# EAGLE design Left (EAGLE 8.2.0)
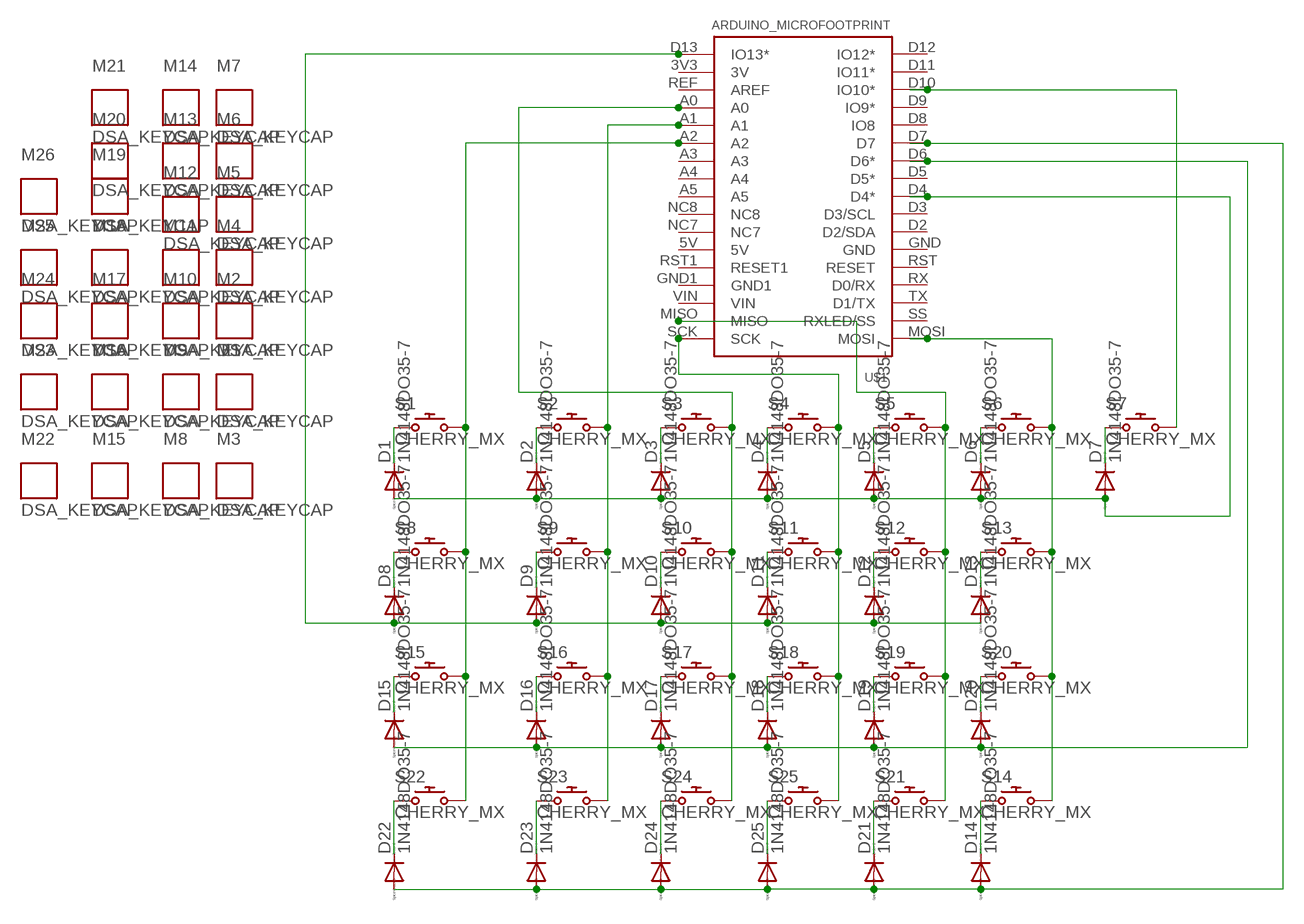
[diagram p0: schematic, sheet 1]

## Parts
D1  1N4148DO35-7  [DO35-7]
D2  1N4148DO35-7  [DO35-7]
D3  1N4148DO35-7  [DO35-7]
D4  1N4148DO35-7  [DO35-7]
D5  1N4148DO35-7  [DO35-7]
D6  1N4148DO35-7  [DO35-7]
D7  1N4148DO35-7  [DO35-7]
D8  1N4148DO35-7  [DO35-7]
D9  1N4148DO35-7  [DO35-7]
D10  1N4148DO35-7  [DO35-7]
D11  1N4148DO35-7  [DO35-7]
D12  1N4148DO35-7  [DO35-7]
D13  1N4148DO35-7  [DO35-7]
D14  1N4148DO35-7  [DO35-7]
D15  1N4148DO35-7  [DO35-7]
D16  1N4148DO35-7  [DO35-7]
D17  1N4148DO35-7  [DO35-7]
D18  1N4148DO35-7  [DO35-7]
D19  1N4148DO35-7  [DO35-7]
D20  1N4148DO35-7  [DO35-7]
D21  1N4148DO35-7  [DO35-7]
D22  1N4148DO35-7  [DO35-7]
D23  1N4148DO35-7  [DO35-7]
D24  1N4148DO35-7  [DO35-7]
D25  1N4148DO35-7  [DO35-7]
M1  DSA_KEYCAP  [DSA_KEYCAP]
M2  DSA_KEYCAP  [DSA_KEYCAP]
M3  DSA_KEYCAP  [DSA_KEYCAP]
M4  DSA_KEYCAP  [DSA_KEYCAP]
M5  DSA_KEYCAP  [DSA_KEYCAP]
M6  DSA_KEYCAP  [DSA_KEYCAP]
M7  DSA_KEYCAP  [DSA_KEYCAP]
M8  DSA_KEYCAP  [DSA_KEYCAP]
M9  DSA_KEYCAP  [DSA_KEYCAP]
M10  DSA_KEYCAP  [DSA_KEYCAP]
M11  DSA_KEYCAP  [DSA_KEYCAP]
M12  DSA_KEYCAP  [DSA_KEYCAP]
M13  DSA_KEYCAP  [DSA_KEYCAP]
M14  DSA_KEYCAP  [DSA_KEYCAP]
M15  DSA_KEYCAP  [DSA_KEYCAP]
M16  DSA_KEYCAP  [DSA_KEYCAP]
M17  DSA_KEYCAP  [DSA_KEYCAP]
M18  DSA_KEYCAP  [DSA_KEYCAP]
M19  DSA_KEYCAP  [DSA_KEYCAP]
M20  DSA_KEYCAP  [DSA_KEYCAP]
M21  DSA_KEYCAP  [DSA_KEYCAP]
M22  DSA_KEYCAP  [DSA_KEYCAP]
M23  DSA_KEYCAP  [DSA_KEYCAP]
M24  DSA_KEYCAP  [DSA_KEYCAP]
M25  DSA_KEYCAP  [DSA_KEYCAP]
M26  DSA_KEYCAP  [DSA_KEYCAP]
S1  CHERRY_MX  [CHERRY_MX]
S2  CHERRY_MX  [CHERRY_MX]
S3  CHERRY_MX  [CHERRY_MX]
S4  CHERRY_MX  [CHERRY_MX]
S5  CHERRY_MX  [CHERRY_MX]
S6  CHERRY_MX  [CHERRY_MX]
S7  CHERRY_MX  [CHERRY_MX]
S8  CHERRY_MX  [CHERRY_MX]
S9  CHERRY_MX  [CHERRY_MX]
S10  CHERRY_MX  [CHERRY_MX]
S11  CHERRY_MX  [CHERRY_MX]
S12  CHERRY_MX  [CHERRY_MX]
S13  CHERRY_MX  [CHERRY_MX]
S14  CHERRY_MX  [CHERRY_MX]
S15  CHERRY_MX  [CHERRY_MX]
S16  CHERRY_MX  [CHERRY_MX]
S17  CHERRY_MX  [CHERRY_MX]
S18  CHERRY_MX  [CHERRY_MX]
S19  CHERRY_MX  [CHERRY_MX]
S20  CHERRY_MX  [CHERRY_MX]
S21  CHERRY_MX  [CHERRY_MX]
S22  CHERRY_MX  [CHERRY_MX]
S23  CHERRY_MX  [CHERRY_MX]
S24  CHERRY_MX  [CHERRY_MX]
S25  CHERRY_MX  [CHERRY_MX]
U$1  ARDUINO_MICROFOOTPRINT  [ARDUINO-MICRO]

## Nets
N$1: D14.A D21.A D22.A D23.A D24.A D25.A U$1.D7
N$3: D8.A D9.A D10.A D11.A D12.A D13.A U$1.D13(IO13*)
N$4: D12.C S12.S1
N$5: S1.S2 S8.S2 S15.S2 S22.S2 U$1.A2
N$6: S2.S2 S9.S2 S16.S2 S23.S2 U$1.A1
N$7: S3.S2 S10.S2 S17.S2 S24.S2 U$1.A0
N$8: S4.S2 S11.S2 S18.S2 S25.S2 U$1.SCK
N$9: S5.S2 S12.S2 S19.S2 S21.S2 U$1.MISO
N$10: S6.S2 S13.S2 S14.S2 S20.S2 U$1.MOSI
N$11: S7.S2 U$1.D10(IO10*)
N$12: D1.C S1.S1
N$13: D8.C S8.S1
N$14: D15.C S15.S1
N$15: D22.C S22.S1
N$16: D23.C S23.S1
N$17: D16.C S16.S1
N$18: D9.C S9.S1
N$19: D2.C S2.S1
N$20: D3.C S3.S1
N$21: D10.C S10.S1
N$22: D17.C S17.S1
N$23: D24.C S24.S1
N$24: D25.C S25.S1
N$25: D18.C S18.S1
N$26: D11.C S11.S1
N$27: D4.C S4.S1
N$28: D5.C S5.S1
N$29: D6.C S6.S1
N$30: D7.C S7.S1
N$31: D14.C S14.S1
N$32: D13.C S13.S1
N$33: D19.C S19.S1
N$34: D20.C S20.S1
N$35: D21.C S21.S1
N$36: D15.A D16.A D17.A D18.A D19.A D20.A U$1.D6(D6*)
N$39: D1.A D2.A D3.A D4.A D5.A D6.A D7.A U$1.D4(D4*)
Unconnected: U$1.3V3(3V) U$1.5V U$1.A3 U$1.A4 U$1.A5 U$1.D2(D2/SDA) U$1.D3(D3/SCL) U$1.D5(D5*) U$1.D8(IO8) U$1.D9(IO9*) U$1.D11(IO11*) U$1.D12(IO12*) U$1.GND U$1.GND1 U$1.NC7 U$1.NC8 U$1.REF(AREF) U$1.RST1(RESET1) U$1.RST(RESET) U$1.RX(D0/RX) U$1.SS(RXLED/SS) U$1.TX(D1/TX) U$1.VIN

## Library data of the parts
D1-D25 = diode:1N4148: DIODE high speed (Philips)
M1-M26 = cherry:DSA_KEYCAP: DSA keycap
S1-S25 = cherry:CHERRY_MX: Cherry keymodule MX; FARNELL: 2292961; MOUSER: 540-MX1A-11NW
U$1 = ArduinoMicro:ARDUINO_MICRO

## Board
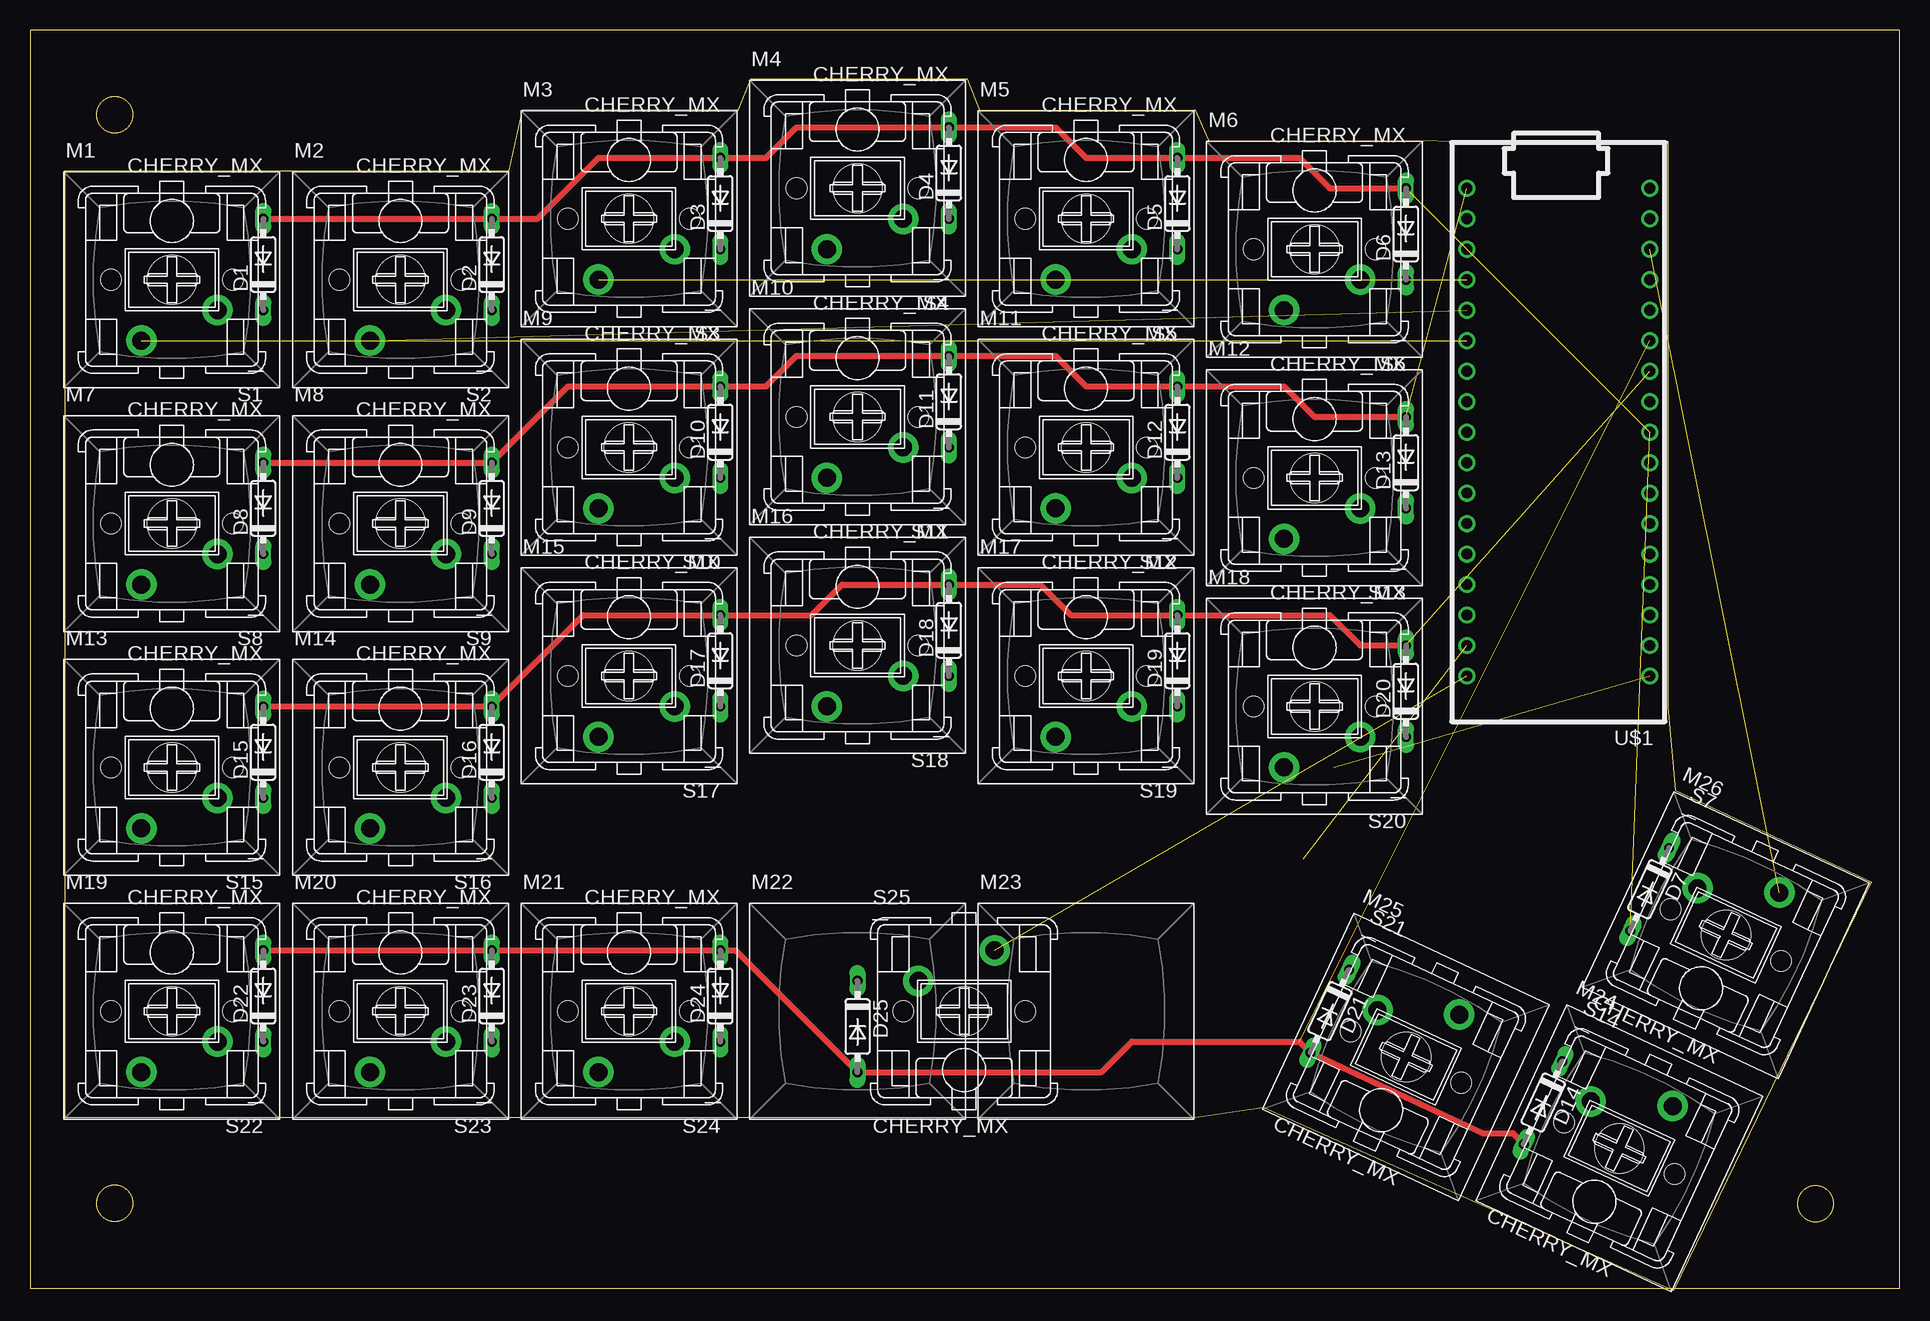
[diagram p1: board, top side]
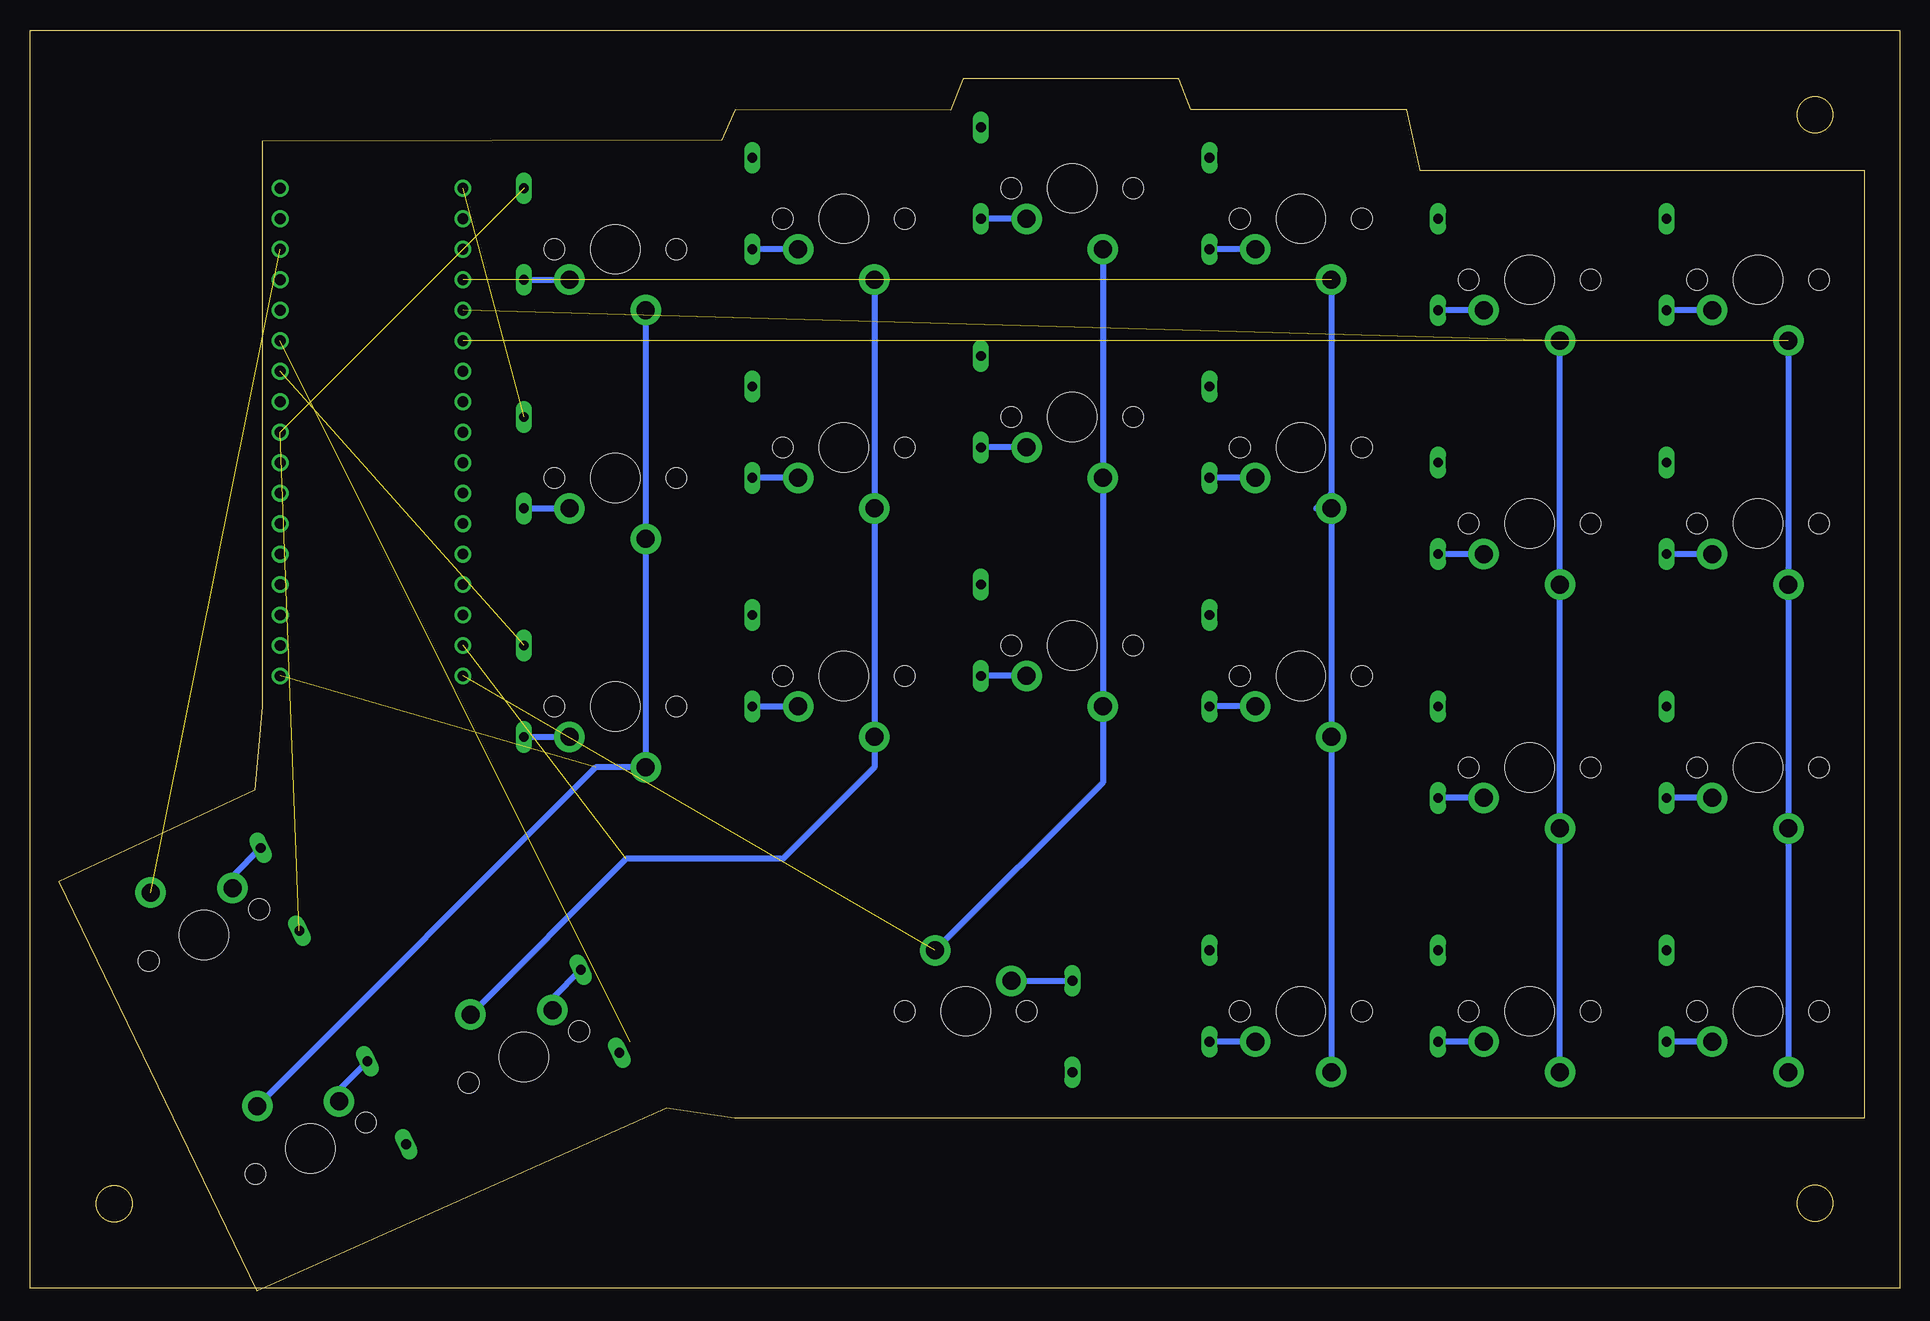
[diagram p2: board, bottom side, seen from below]

Size 155.86 x 105.08 mm. Coordinates in mm from the lower left corner, seen from the top.
Outline: 41.07,98.44 59.07,98.44 60.09,101.02 78.09,101.02 79.14,98.41 97.11,98.44 98.22,95.9 136.5,95.79 136.5,48.7 137.14,41.74 153.47,34.09 136.97,0 102.82,15.25 97.14,14.44 2.94,14.44 2.94,93.33 39.96,93.36 41.07,98.44
Outline: 0,0.21 155.86,0.21 155.86,105.08 0,105.08 0,0.21
Outline: circle at 7.07,98.01 radius 1.5
Outline: circle at 7.07,7.32 radius 1.5
Outline: circle at 148.83,7.28 radius 1.5
Copper layers (1*16): Top 0.035mm / dielectric 1.5mm / Bottom 0.035mm
Design rules "default *": minimum track width 6mil, minimum drill 0.35mm, track to track 12mil, track to pad 6mil, pad to pad 6mil, via to via 6mil, smd to smd 6mil, copper to edge 40mil, drill to drill 40mil, minimum pad ring 10mil, minimum via ring 8mil, stop-mask expansion 4mil, vias tented up to drill 0mil, thermal gap 10mil

### Footprints (pad centres in the part's own frame; a part is rotated, then mirrored left to right if it is on the bottom)
DO35-7 = drill 0.813 long: A 3.81,0; C -3.81,0
CHERRY_MX = drill 1.5 pad 2.54: S1 -3.81,2.54; S2 2.54,5.08 | hole 1.7: -5.08,0; 5.08,0 | hole 4.1: 0,0
ARDUINO-MICRO = drill 0.9: 3V3 16.51,3.81; 5V 16.51,29.21; A0 16.51,8.89; A1 16.51,11.43; A2 16.51,13.97; A3 16.51,16.51; A4 16.51,19.05; A5 16.51,21.59; D2 1.27,26.67; D3 1.27,24.13; D4 1.27,21.59; D5 1.27,19.05; D6 1.27,16.51; D7 1.27,13.97; D8 1.27,11.43; D9 1.27,8.89; D10 1.27,6.35; D11 1.27,3.81; D12 1.27,1.27; D13 16.51,1.27; GND 1.27,29.21; GND1 16.51,34.29; MISO 16.51,39.37; MOSI 1.27,41.91; NC7 16.51,26.67; NC8 16.51,24.13; REF 16.51,6.35; RST 1.27,31.75; RST1 16.51,31.75; RX 1.27,34.29; SCK 16.51,41.91; SS 1.27,39.37; TX 1.27,36.83; VIN 16.51,36.83

### Placement (x,y rotation side)
D1  19.45,85.54 90 top
D2  38.5,85.54 90 top
D3  57.55,90.62 90 top
D4  76.6,93.16 90 top
D5  95.65,90.62 90 top
D6  114.7,88.08 90 top
D7  135.02,33.47 245 top
D8  19.45,65.22 90 top
D9  38.5,65.22 90 top
D10  57.55,71.57 90 top
D11  76.6,74.11 90 top
D12  95.65,71.57 90 top
D13  114.7,69.03 90 top
D14  126.13,15.69 245 top
D15  19.45,44.9 90 top
D16  38.5,44.9 90 top
D17  57.55,52.52 90 top
D18  76.6,55.06 90 top
D19  95.65,52.52 90 top
D20  114.7,49.98 90 top
D21  108.35,23.31 245 top
D22  19.45,24.58 90 top
D23  38.5,24.58 90 top
D24  57.55,24.58 90 top
D25  68.98,22.04 270 top
M1  11.83,84.27 0 top
M2  30.88,84.27 0 top
M3  49.93,89.35 0 top
M4  68.98,91.89 0 top
M5  88.03,89.35 0 top
M6  107.08,86.81 0 top
M7  11.83,63.95 0 top
M8  30.88,63.95 0 top
M9  49.93,70.3 0 top
M10  68.98,72.84 0 top
M11  88.03,70.3 0 top
M12  107.08,67.76 0 top
M13  11.83,43.63 0 top
M14  30.88,43.63 0 top
M15  49.93,51.25 0 top
M16  68.98,53.79 0 top
M17  88.03,51.25 0 top
M18  107.08,48.71 0 top
M19  11.83,23.31 0 top
M20  30.88,23.31 0 top
M21  49.93,23.31 0 top
M22  68.98,23.31 0 top
M23  88.03,23.31 0 top
M24  132.48,11.88 335 top
M25  114.7,19.5 335 top
M26  141.37,29.66 335 top
S1  11.83,84.27 180 top
S2  30.88,84.27 180 top
S3  49.93,89.35 180 top
S4  68.98,91.89 180 top
S5  88.03,89.35 180 top
S6  107.08,86.81 180 top
S7  141.37,29.66 335 top
S8  11.83,63.95 180 top
S9  30.88,63.95 180 top
S10  49.93,70.3 180 top
S11  68.98,72.84 180 top
S12  88.03,70.3 180 top
S13  107.08,67.76 180 top
S14  132.48,11.88 335 top
S15  11.83,43.63 180 top
S16  30.88,43.63 180 top
S17  49.93,51.25 180 top
S18  68.98,53.79 180 top
S19  88.03,51.25 180 top
S20  107.08,48.71 180 top
S21  114.7,19.5 335 top
S22  11.83,23.31 180 top
S23  30.88,23.31 180 top
S24  49.93,23.31 180 top
S25  77.87,23.31 0 top
U$1  136.29,93.16 180 top

### Tracks (layer width: path | path; a pad name or v marks a point on that pad's centre or on a via)
N$1  (1 unrouted)
  Top 0.508: D22.A D23.A D24.A 58.82,28.39 D25.A 89.3,18.23 91.84,20.77 105.82,20.77 D21.A 121.05,13.15 123.6,13.15 D14.A
N$3  (1 unrouted)
  Top 0.508: D8.A D9.A 44.85,75.38 D10.A 61.36,75.38 63.9,77.92 D11.A 85.49,77.92 88.03,75.38 D12.A 104.54,75.38 107.08,72.84 D13.A
N$4
  Bottom 0.508: S12.S1 D12.C
N$5  (1 unrouted)
  Bottom 0.508: S1.S2 S8.S2 | S8.S2 9.29,57.6 S8.S2 | S8.S2 S15.S2 S22.S2
N$6  (1 unrouted)
  Bottom 0.508: S23.S2 S16.S2 S9.S2 S2.S2
N$7  (1 unrouted)
  Bottom 0.508: S3.S2 47.39,66.49 48.66,65.22 S10.S2 S17.S2 S24.S2
N$8  (1 unrouted)
  Bottom 0.508: S4.S2 S11.S2 S18.S2 66.44,42.36 S25.S2
N$9  (1 unrouted)
  Bottom 0.508: S5.S2 S12.S2 S19.S2 85.49,43.63 93.11,36.01 106.17,36.01 S21.S2
N$10  (1 unrouted)
  Bottom 0.508: S6.S2 S13.S2 S20.S2 108.71,43.63 S14.S2
N$11  (1 unrouted)
N$12
  Bottom 0.508: S1.S1 D1.C
N$13
  Bottom 0.508: S8.S1 D8.C
N$14
  Bottom 0.508: S15.S1 D15.C
N$15
  Bottom 0.508: S22.S1 D22.C
N$16
  Bottom 0.508: S23.S1 D23.C
N$17
  Bottom 0.508: S16.S1 D16.C
N$18
  Bottom 0.508: S9.S1 D9.C
N$19
  Bottom 0.508: S2.S1 D2.C
N$20
  Bottom 0.508: S3.S1 D3.C
N$21
  Bottom 0.508: S10.S1 D10.C
N$22
  Bottom 0.508: S17.S1 D17.C
N$23
  Bottom 0.508: S24.S1 D24.C
N$24
  Bottom 0.508: S25.S1 D25.C
N$25
  Bottom 0.508: S18.S1 D18.C
N$26
  Bottom 0.508: S11.S1 D11.C
N$27
  Bottom 0.508: S4.S1 D4.C
N$28
  Bottom 0.508: S5.S1 D5.C
N$29
  Bottom 0.508: D6.C S6.S1
N$30
  Bottom 0.508: S7.S1 138.99,34.56 D7.C
N$31
  Bottom 0.508: S14.S1 130.1,16.78 D14.C
N$32
  Bottom 0.508: D13.C S13.S1
N$33
  Bottom 0.508: D19.C S19.S1
N$34
  Bottom 0.508: D20.C S20.S1
N$35
  Bottom 0.508: S21.S1 112.32,24.4 D21.C
N$36  (1 unrouted)
  Top 0.508: D15.A D16.A 46.12,56.33 D17.A 65.17,56.33 67.71,58.87 D18.A 84.22,58.87 86.76,56.33 D19.A 108.35,56.33 110.89,53.79 D20.A
N$39  (2 unrouted)
  Top 0.508: D1.A D2.A 42.31,89.35 47.39,94.43 D3.A 61.36,94.43 63.9,96.97 D4.A 85.49,96.97 88.03,94.43 D5.A 105.81,94.43 108.35,91.89 D6.A